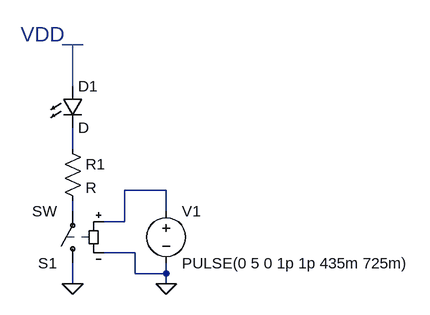
[diagram p0: schematic task1.asc]
task1.asc, the LTspice schematic file:
Version 4
SHEET 1 880 680
WIRE 256 128 256 112
WIRE 256 208 256 176
WIRE 400 272 336 272
WIRE 256 304 256 288
WIRE 400 304 400 272
WIRE 336 320 336 272
WIRE 336 320 304 320
WIRE 352 368 304 368
WIRE 352 400 352 368
WIRE 400 400 400 384
WIRE 400 400 352 400
WIRE 256 416 256 384
WIRE 400 416 400 400
FLAG 256 416 0
FLAG 400 416 0
SYMBOL LED 240 112 R0
SYMATTR InstName D1
SYMBOL res 240 192 R0
SYMATTR InstName R1
SYMBOL sw 256 400 R180
SYMATTR InstName S1
SYMBOL voltage 400 288 R0
WINDOW 123 0 0 Left 0
WINDOW 39 0 0 Left 0
SYMATTR InstName V1
SYMATTR Value PULSE(0 5 0 1p 1p 435m 725m)
TEXT 176 32 Left 3 ;VDD
LINE Normal 256 48 256 112
LINE Normal 240 48 256 48
LINE Normal 272 48 240 48
LINE Normal 272 48 272 48 2
LINE Normal 272 48 272 48 2

The netlist it stands for:
* task1.asc
D1 N001 N002 D
R1 N002 N004 R
S1 0 N004 N003 0 SW
V1 N003 0 PULSE(0 5 0 1p 1p 435m 725m)
.model D D
.lib standard.dio
* VDD
.backanno
.end